# Altium schematic sheet [2]-BLOCK_DIAGRAM.SchDoc
size A4
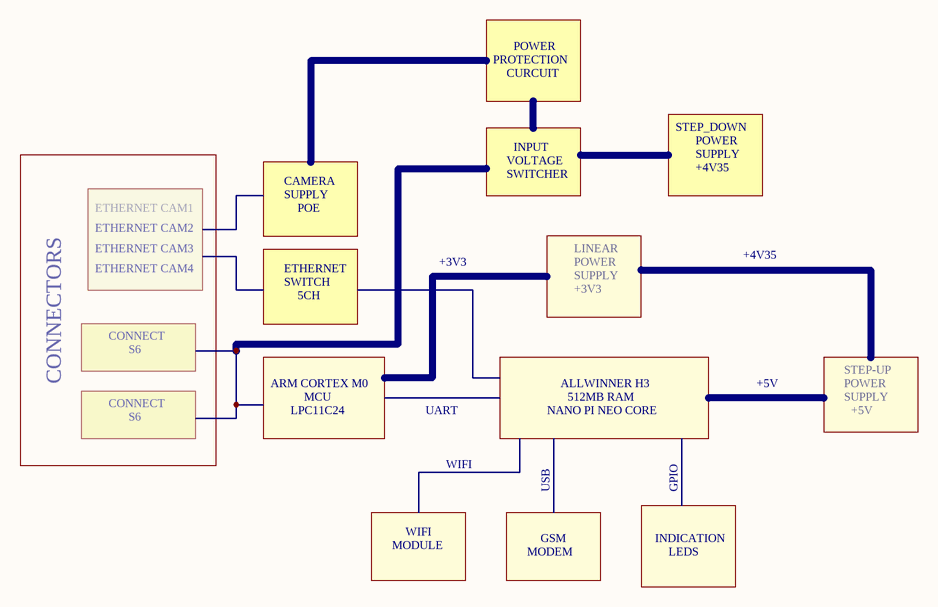
[diagram p0: [2]-BLOCK_DIAGRAM.SchDoc]

## Notes on the sheet
- POWER
- PROTECTION
- CURCUIT
- CAMERA
- VOLTAGE
- SWITCHER
- INPUT
- STEP_DOWN
- SUPPLY
- +4V35
- ETHERNET CAM1
- ETHERNET CAM2
- ETHERNET CAM3
- POE
- LINEAR
- ETHERNET CAM4
- ETHERNET
- SWITCH
- 5CH
- +3V3
- CONNECTORS
- CONNECT
- S6
- ARM CORTEX M0
- ALLWINNER H3
- +5V
- STEP-UP
- LPC11C24
- MCU
- UART
- NANO PI NEO CORE
- 512MB RAM
- WIFI
- USB
- GPIO
- MODULE
- MODEM
- GSM
- INDICATION
- LEDS